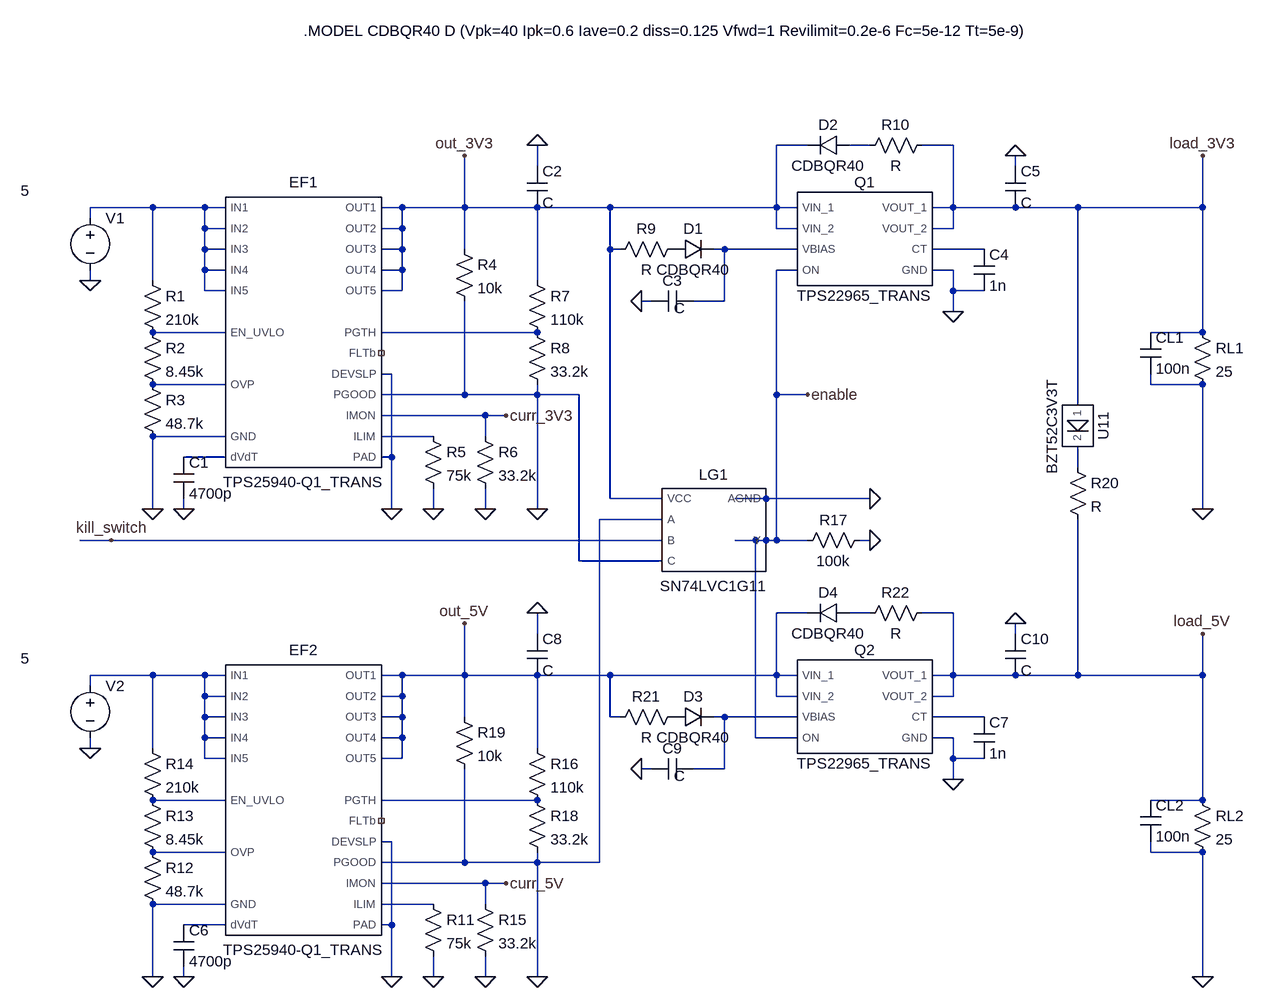
[diagram p0: schematic power_management.asc]
power_management.asc, the LTspice schematic file:
Version 4
SHEET 1 2012 1192
WIRE 768 -128 720 -128
WIRE 864 -128 832 -128
WIRE 992 -128 944 -128
WIRE 352 -96 352 -128
WIRE 1088 -96 1088 -112
WIRE -240 -32 -336 -32
WIRE -160 -32 -240 -32
WIRE -128 -32 -160 -32
WIRE 144 -32 112 -32
WIRE 240 -32 240 -112
WIRE 240 -32 144 -32
WIRE 352 -32 240 -32
WIRE 464 -32 352 -32
WIRE 720 -32 720 -128
WIRE 720 -32 464 -32
WIRE 752 -32 720 -32
WIRE 992 -32 992 -128
WIRE 992 -32 960 -32
WIRE 1088 -32 992 -32
WIRE 1184 -32 1088 -32
WIRE 1376 -32 1376 -112
WIRE 1376 -32 1184 -32
WIRE -336 -16 -336 -32
WIRE -160 0 -160 -32
WIRE -128 0 -160 0
WIRE 144 0 144 -32
WIRE 144 0 112 0
WIRE 720 0 720 -32
WIRE 752 0 720 0
WIRE 992 0 992 -32
WIRE 992 0 960 0
WIRE -160 32 -160 0
WIRE -128 32 -160 32
WIRE 144 32 144 0
WIRE 144 32 112 32
WIRE 240 32 240 -32
WIRE 464 32 464 -32
WIRE 480 32 464 32
WIRE 640 32 624 32
WIRE 752 32 640 32
WIRE 1040 32 960 32
WIRE -160 64 -160 32
WIRE -128 64 -160 64
WIRE 144 64 144 32
WIRE 144 64 112 64
WIRE 752 64 720 64
WIRE 992 64 960 64
WIRE -336 80 -336 64
WIRE -240 80 -240 -32
WIRE 352 80 352 -32
WIRE -160 96 -160 64
WIRE -128 96 -160 96
WIRE 144 96 144 64
WIRE 144 96 112 96
WIRE 992 96 992 64
WIRE 1040 96 992 96
WIRE 528 112 512 112
WIRE 640 112 640 32
WIRE 640 112 592 112
WIRE 992 128 992 96
WIRE -128 160 -240 160
WIRE 352 160 112 160
WIRE 1376 160 1376 -32
WIRE 1376 160 1296 160
WIRE 128 224 112 224
WIRE -128 240 -240 240
WIRE 1296 240 1296 224
WIRE 1376 240 1296 240
WIRE 240 256 240 112
WIRE 240 256 112 256
WIRE 352 256 352 240
WIRE 352 256 240 256
WIRE 416 256 352 256
WIRE 720 256 720 64
WIRE 768 256 720 256
WIRE 1184 272 1184 -32
WIRE 272 288 112 288
WIRE 304 288 272 288
WIRE -128 320 -240 320
WIRE 192 320 112 320
WIRE 272 320 272 288
WIRE -128 352 -192 352
WIRE 128 352 128 224
WIRE 128 352 112 352
WIRE 1184 368 1184 336
WIRE 464 416 464 32
WIRE 544 416 464 416
WIRE 864 416 656 416
WIRE -240 432 -240 320
WIRE -192 432 -192 416
WIRE 128 432 128 352
WIRE 192 432 192 400
WIRE 272 432 272 400
WIRE 352 432 352 256
WIRE 1376 432 1376 240
WIRE 544 448 448 448
WIRE -304 480 -352 480
WIRE 544 480 -304 480
WIRE 688 480 656 480
WIRE 720 480 720 256
WIRE 720 480 688 480
WIRE 768 480 720 480
WIRE 864 480 848 480
WIRE 416 512 416 256
WIRE 544 512 416 512
WIRE 768 592 720 592
WIRE 864 592 832 592
WIRE 992 592 944 592
WIRE 352 624 352 592
WIRE 1088 624 1088 608
WIRE -240 688 -336 688
WIRE -160 688 -240 688
WIRE -128 688 -160 688
WIRE 144 688 112 688
WIRE 240 688 240 608
WIRE 240 688 144 688
WIRE 352 688 240 688
WIRE 464 688 352 688
WIRE 720 688 720 592
WIRE 720 688 464 688
WIRE 752 688 720 688
WIRE 992 688 992 592
WIRE 992 688 960 688
WIRE 1088 688 992 688
WIRE 1184 688 1184 448
WIRE 1184 688 1088 688
WIRE 1376 688 1376 624
WIRE 1376 688 1184 688
WIRE -336 704 -336 688
WIRE -160 720 -160 688
WIRE -128 720 -160 720
WIRE 144 720 144 688
WIRE 144 720 112 720
WIRE 720 720 720 688
WIRE 752 720 720 720
WIRE 992 720 992 688
WIRE 992 720 960 720
WIRE -160 752 -160 720
WIRE -128 752 -160 752
WIRE 144 752 144 720
WIRE 144 752 112 752
WIRE 240 752 240 688
WIRE 464 752 464 688
WIRE 480 752 464 752
WIRE 640 752 624 752
WIRE 752 752 640 752
WIRE 1040 752 960 752
WIRE -160 784 -160 752
WIRE -128 784 -160 784
WIRE 144 784 144 752
WIRE 144 784 112 784
WIRE 688 784 688 480
WIRE 752 784 688 784
WIRE 992 784 960 784
WIRE -336 800 -336 784
WIRE -240 800 -240 688
WIRE 352 800 352 688
WIRE -160 816 -160 784
WIRE -128 816 -160 816
WIRE 144 816 144 784
WIRE 144 816 112 816
WIRE 992 816 992 784
WIRE 1040 816 992 816
WIRE 528 832 512 832
WIRE 640 832 640 752
WIRE 640 832 592 832
WIRE 992 848 992 816
WIRE -128 880 -240 880
WIRE 352 880 112 880
WIRE 1376 880 1376 688
WIRE 1376 880 1296 880
WIRE 128 944 112 944
WIRE -128 960 -240 960
WIRE 1296 960 1296 944
WIRE 1376 960 1296 960
WIRE 240 976 240 832
WIRE 240 976 112 976
WIRE 352 976 352 960
WIRE 352 976 240 976
WIRE 448 976 448 448
WIRE 448 976 352 976
WIRE 272 1008 112 1008
WIRE 304 1008 272 1008
WIRE -128 1040 -240 1040
WIRE 192 1040 112 1040
WIRE 272 1040 272 1008
WIRE -128 1072 -192 1072
WIRE 128 1072 128 944
WIRE 128 1072 112 1072
WIRE -240 1152 -240 1040
WIRE -192 1152 -192 1136
WIRE 128 1152 128 1072
WIRE 192 1152 192 1120
WIRE 272 1152 272 1120
WIRE 352 1152 352 976
WIRE 1376 1152 1376 960
FLAG -192 432 0
FLAG 128 432 0
FLAG 192 432 0
FLAG -240 432 0
FLAG -336 80 0
FLAG 272 432 0
FLAG 304 288 curr_3V3
FLAG 240 -112 out_3V3
FLAG 352 432 0
FLAG 1376 432 0
FLAG 992 128 0
FLAG 864 480 0
FLAG 352 -128 0
FLAG 512 112 0
FLAG 864 416 0
FLAG 1088 -112 0
FLAG -192 1152 0
FLAG 128 1152 0
FLAG 192 1152 0
FLAG -240 1152 0
FLAG -336 800 0
FLAG 272 1152 0
FLAG 304 1008 curr_5V
FLAG 240 608 out_5V
FLAG 352 1152 0
FLAG 1376 1152 0
FLAG 992 848 0
FLAG 352 592 0
FLAG 512 832 0
FLAG 1088 608 0
FLAG 1376 624 load_5V
FLAG 1376 -112 load_3V3
FLAG 768 256 enable
FLAG -304 480 kill_switch
SYMBOL res 176 304 R0
SYMATTR InstName R5
SYMATTR Value 75k
SYMBOL res -256 224 R0
SYMATTR InstName R3
SYMATTR Value 48.7k
SYMBOL res -256 144 R0
SYMATTR InstName R2
SYMATTR Value 8.45k
SYMBOL res -256 64 R0
SYMATTR InstName R1
SYMATTR Value 210k
SYMBOL voltage -336 -32 R0
WINDOW 123 0 0 Left 0
WINDOW 39 0 0 Left 0
WINDOW 3 -107 -26 Left 2
SYMATTR Value 5
SYMATTR InstName V1
SYMBOL res 256 304 R0
SYMATTR InstName R6
SYMATTR Value 33.2k
SYMBOL cap -208 352 R0
SYMATTR InstName C1
SYMATTR Value 4700p
SYMBOL res 336 64 R0
SYMATTR InstName R7
SYMATTR Value 110k
SYMBOL res 336 144 R0
SYMATTR InstName R8
SYMATTR Value 33.2k
SYMBOL res 224 16 R0
SYMATTR InstName R4
SYMATTR Value 10k
SYMBOL res 1360 144 R0
SYMATTR InstName RL1
SYMATTR Value 25
SYMBOL res 864 464 R90
WINDOW 0 0 56 VBottom 2
WINDOW 3 32 56 VTop 2
SYMATTR InstName R17
SYMATTR Value 100k
SYMBOL cap 1024 32 R0
SYMATTR InstName C4
SYMATTR Value 1n
SYMBOL cap 1280 160 R0
SYMATTR InstName CL1
SYMATTR Value 100n
SYMBOL AutoGenerated\\TPS22965_TRANS 848 16 R0
SYMATTR InstName Q1
SYMBOL AutoGenerated\\TPS25940-Q1_TRANS -16 128 R0
SYMATTR InstName EF1
SYMBOL diode 560 48 R270
WINDOW 0 32 32 VTop 2
WINDOW 3 0 32 VBottom 2
SYMATTR InstName D1
SYMATTR Value CDBQR40
SYMBOL AutoGenerated\\BZT52C3V3T 1184 304 R90
SYMATTR InstName U11
SYMBOL cap 336 -96 R0
SYMATTR InstName C2
SYMBOL AutoGenerated\\SN74LVC1G11 592 464 R0
SYMATTR InstName LG1
SYMBOL res 576 16 R90
WINDOW 0 0 56 VBottom 2
WINDOW 3 32 56 VTop 2
SYMATTR InstName R9
SYMBOL cap 592 96 R90
WINDOW 0 0 32 VBottom 2
WINDOW 3 11 21 VTop 2
SYMATTR InstName C3
SYMBOL diode 832 -144 R90
WINDOW 0 0 32 VBottom 2
WINDOW 3 32 32 VTop 2
SYMATTR InstName D2
SYMATTR Value CDBQR40
SYMBOL res 960 -144 R90
WINDOW 0 0 56 VBottom 2
WINDOW 3 32 56 VTop 2
SYMATTR InstName R10
SYMBOL cap 1072 -96 R0
SYMATTR InstName C5
SYMBOL res 176 1024 R0
SYMATTR InstName R11
SYMATTR Value 75k
SYMBOL res -256 944 R0
SYMATTR InstName R12
SYMATTR Value 48.7k
SYMBOL res -256 864 R0
SYMATTR InstName R13
SYMATTR Value 8.45k
SYMBOL res -256 784 R0
SYMATTR InstName R14
SYMATTR Value 210k
SYMBOL voltage -336 688 R0
WINDOW 123 0 0 Left 0
WINDOW 39 0 0 Left 0
WINDOW 3 -107 -26 Left 2
SYMATTR Value 5
SYMATTR InstName V2
SYMBOL res 256 1024 R0
SYMATTR InstName R15
SYMATTR Value 33.2k
SYMBOL cap -208 1072 R0
SYMATTR InstName C6
SYMATTR Value 4700p
SYMBOL res 336 784 R0
SYMATTR InstName R16
SYMATTR Value 110k
SYMBOL res 336 864 R0
SYMATTR InstName R18
SYMATTR Value 33.2k
SYMBOL res 224 736 R0
SYMATTR InstName R19
SYMATTR Value 10k
SYMBOL res 1360 864 R0
SYMATTR InstName RL2
SYMATTR Value 25
SYMBOL cap 1024 752 R0
SYMATTR InstName C7
SYMATTR Value 1n
SYMBOL cap 1280 880 R0
SYMATTR InstName CL2
SYMATTR Value 100n
SYMBOL AutoGenerated\\TPS22965_TRANS 848 736 R0
SYMATTR InstName Q2
SYMBOL AutoGenerated\\TPS25940-Q1_TRANS -16 848 R0
SYMATTR InstName EF2
SYMBOL diode 560 768 R270
WINDOW 0 32 32 VTop 2
WINDOW 3 0 32 VBottom 2
SYMATTR InstName D3
SYMATTR Value CDBQR40
SYMBOL cap 336 624 R0
SYMATTR InstName C8
SYMBOL res 576 736 R90
WINDOW 0 0 56 VBottom 2
WINDOW 3 32 56 VTop 2
SYMATTR InstName R21
SYMBOL cap 592 816 R90
WINDOW 0 0 32 VBottom 2
WINDOW 3 11 21 VTop 2
SYMATTR InstName C9
SYMBOL diode 832 576 R90
WINDOW 0 0 32 VBottom 2
WINDOW 3 32 32 VTop 2
SYMATTR InstName D4
SYMATTR Value CDBQR40
SYMBOL res 960 576 R90
WINDOW 0 0 56 VBottom 2
WINDOW 3 32 56 VTop 2
SYMATTR InstName R22
SYMBOL cap 1072 624 R0
SYMATTR InstName C10
SYMBOL res 1168 352 R0
SYMATTR InstName R20
TEXT -8 -304 Left 2 !.MODEL CDBQR40 D (Vpk=40 Ipk=0.6 Iave=0.2 diss=0.125 Vfwd=1 Revilimit=0.2e-6 Fc=5e-12 Tt=5e-9)

The netlist it stands for:
* power_management.asc
R5 N008 0 75k
R3 N007 0 48.7k
R2 N005 N007 8.45k
R1 N002 N005 210k
V1 N002 0 5
R6 curr_3V3 0 33.2k
C1 N009 0 4700p
R7 out_3V3 N006 110k
R8 N006 0 33.2k
R4 out_3V3 0 10k
RL1 load_3V3 0 25
R17 0 enable 100k
C4 N004 0 1n
CL1 load_3V3 0 100n
XQ1 N004 enable out_3V3 out_3V3 load_3V3 load_3V3 N003 0 TPS22965_TRANS  ; pins CT ON VIN_1 VIN_2 VOUT_1 VOUT_2 VBIAS GND
XEF1 0 0 N006 out_3V3 out_3V3 out_3V3 out_3V3 out_3V3 N002 N002 N002 N002 N002 N005 N007 0 N008 N009 curr_3V3 NC_01 0 TPS25940-Q1_TRANS  ; pins DEVSLP PGOOD PGTH OUT5 OUT1 OUT2 OUT3 OUT4 IN5 IN1 IN2 IN3 IN4 EN_UVLO OVP GND ILIM dVdT IMON FLTb PAD
D1 P001 N003 CDBQR40
XU11 load_3V3 N010 BZT52C3V3T  ; pins 1 2
C2 0 out_3V3 C
XLG1 enable 0 kill_switch 0 out_3V3 0 SN74LVC1G11  ; pins Y A B C VCC AGND
R9 P001 out_3V3 R
C3 N003 0 C
D2 N001 out_3V3 CDBQR40
R10 load_3V3 N001 R
C5 0 load_3V3 C
R11 N018 0 75k
R12 N017 0 48.7k
R13 N015 N017 8.45k
R14 N012 N015 210k
V2 N012 0 5
R15 curr_5V 0 33.2k
C6 N019 0 4700p
R16 out_5V N016 110k
R18 N016 0 33.2k
R19 out_5V 0 10k
RL2 load_5V 0 25
C7 N014 0 1n
CL2 load_5V 0 100n
XQ2 N014 enable out_5V out_5V load_5V load_5V N013 0 TPS22965_TRANS  ; pins CT ON VIN_1 VIN_2 VOUT_1 VOUT_2 VBIAS GND
XEF2 0 0 N016 out_5V out_5V out_5V out_5V out_5V N012 N012 N012 N012 N012 N015 N017 0 N018 N019 curr_5V NC_02 0 TPS25940-Q1_TRANS  ; pins DEVSLP PGOOD PGTH OUT5 OUT1 OUT2 OUT3 OUT4 IN5 IN1 IN2 IN3 IN4 EN_UVLO OVP GND ILIM dVdT IMON FLTb PAD
D3 P002 N013 CDBQR40
C8 0 out_5V C
R21 P002 out_5V R
C9 N013 0 C
D4 N011 out_5V CDBQR40
R22 load_5V N011 R
C10 0 load_5V C
R20 N010 load_5V R
.model D D
.lib standard.dio
.MODEL CDBQR40 D (Vpk=40 Ipk=0.6 Iave=0.2 diss=0.125 Vfwd=1 Revilimit=0.2e-6 Fc=5e-12 Tt=5e-9)
.lib C:\Users\Filip.Filip\Documents\VST104\SpiceSimulations\LTSpiceModels\TPS22965_TRANS.lib
.lib C:\Users\Filip.Filip\Documents\VST104\SpiceSimulations\LTSpiceModels\TPS25940-Q1_TRANS.lib
.lib C:\Users\Filip.Filip\Documents\VST104\SpiceSimulations\LTSpiceModels\BZT52C3V3T.spice.txt
.lib C:\Users\Filip.Filip\Documents\VST104\SpiceSimulations\LTSpiceModels\SN74LVC1G11.cir
.backanno
.end